# EAGLE design adapter (EAGLE 6.4)
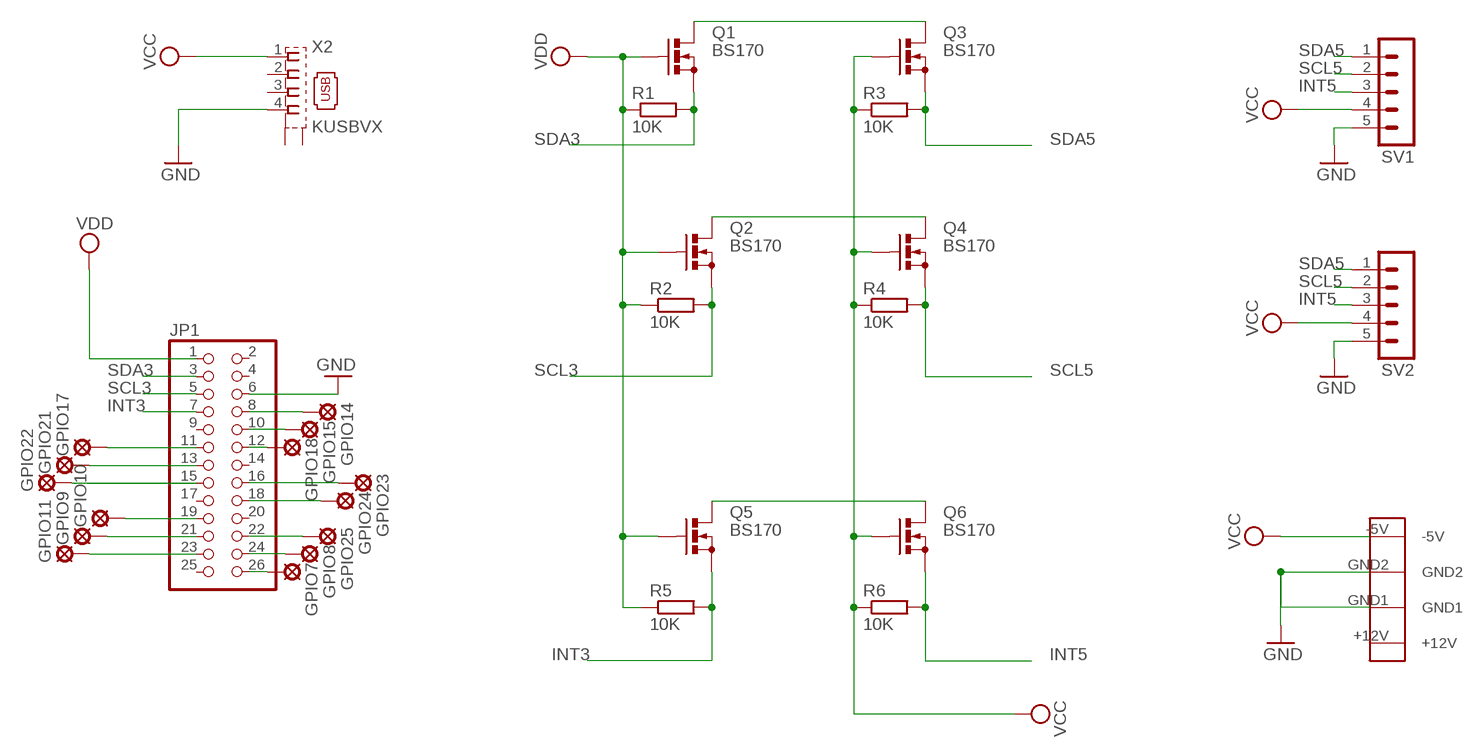
[diagram p0: schematic, sheet 1]

## Parts
GPIO7  LSP10  [LSP10]
GPIO8  LSP10  [LSP10]
GPIO9  LSP10  [LSP10]
GPIO10  LSP10  [LSP10]
GPIO11  LSP10  [LSP10]
GPIO14  LSP10  [LSP10]
GPIO15  LSP10  [LSP10]
GPIO17  GPIO17  LSP10  [LSP10]
GPIO18  LSP10  [LSP10]
GPIO21  LSP10  [LSP10]
GPIO22  LSP10  [LSP10]
GPIO23  LSP10  [LSP10]
GPIO24  LSP10  [LSP10]
GPIO25  LSP10  [LSP10]
JP1  PINHD-2X13  [2X13]
Q1  BS170  [SOT54E]
Q2  BS170  [SOT54E]
Q3  BS170  [SOT54E]
Q4  BS170  [SOT54E]
Q5  BS170  [SOT54E]
Q6  BS170  [SOT54E]
R1  10K  R-EU_0207/2V  [0207/2V]
R2  10K  R-EU_0207/2V  [0207/2V]
R3  10K  R-EU_0207/2V  [0207/2V]
R4  10K  R-EU_0207/2V  [0207/2V]
R5  10K  R-EU_0207/2V  [0207/2V]
R6  10K  R-EU_0207/2V  [0207/2V]
SV1  MA05-1  [MA05-1]
SV2  MA05-1  [MA05-1]
U$1  PSW_5  [PSW_5]
X2  KUSBVX  [KUSBVX]

## Nets
GND: JP1.6 SV1.5 SV2.5 U$1.GND1 U$1.GND2 X2.4
INT3: JP1.7 Q5.S R5.2
INT5: Q6.S R6.2 SV1.3 SV2.3
N$1: GPIO17.MP JP1.11
N$2: GPIO21.MP JP1.13
N$3: GPIO22.MP JP1.15
N$4: GPIO10.MP JP1.19
N$5: GPIO9.MP JP1.21
N$6: GPIO11.MP JP1.23
N$7: GPIO14.MP JP1.8
N$8: GPIO15.MP JP1.10
N$9: GPIO18.MP JP1.12
N$10: GPIO23.MP JP1.16
N$11: GPIO24.MP JP1.18
N$12: GPIO25.MP JP1.22
N$13: GPIO8.MP JP1.24
N$14: GPIO7.MP JP1.26
N$15: Q1.D Q3.D
N$16: Q2.D Q4.D
N$17: Q5.D Q6.D
SCL3: JP1.5 Q2.S R2.2
SCL5: Q4.S R4.2 SV1.2 SV2.2
SDA3: JP1.3 Q1.S R1.2
SDA5: Q3.S R3.2 SV1.1 SV2.1
VCC: Q3.G Q4.G Q6.G R3.1 R4.1 R6.1 SV1.4 SV2.4 U$1.-5V X2.1
VDD: JP1.1 Q1.G Q2.G Q5.G R1.1 R2.1 R5.1
Unconnected: JP1.2 JP1.4 JP1.9 JP1.14 JP1.17 JP1.20 JP1.25 U$1.+12V X2.2 X2.3 X2.M1(S1) X2.M2(S2)

## Library data of the parts
GPIO7-GPIO11 GPIO14 GPIO15 GPIO17 GPIO18 GPIO21-GPIO25 = solpad:LSP10: SOLDER PAD drill 1.0 mm, distributor Buerklin, 12H555
JP1 = pinhead:PINHD-2X13: PIN HEADER
Q1-Q6 = transistor-small-signal:BS170: N-CHANNEL MOS FET
R1-R6 = resistor:R-EU_: RESISTOR, European symbol
SV1 SV2 = con-lstb:MA05-1: PIN HEADER; OC_FARNELL: unknown; OC_NEWARK: unknown
U$1 = n39:PSW_5: PSW 5 Stromversorgungsstecker f. 5 1/4 Zoll, Print, gew. http://www.reichelt.de/Floppy-Powerstecker/PSW-5/3/index.html?;ACTION=3;LA=446;ARTICLE=14915;GROUPID=3257;artnr=PSW+5;SID=11UOMKs38AAAIAABbvFEc5b11be4da1ac9cc045b827e422a49e7b
X2 = con-kycon:KUSBVX: Vertical,Top Entry Universal Serial Bus Connector KUSBVX Series Source: KYCON Sibalco USB vertical socket KUSBV.pdf

## Board
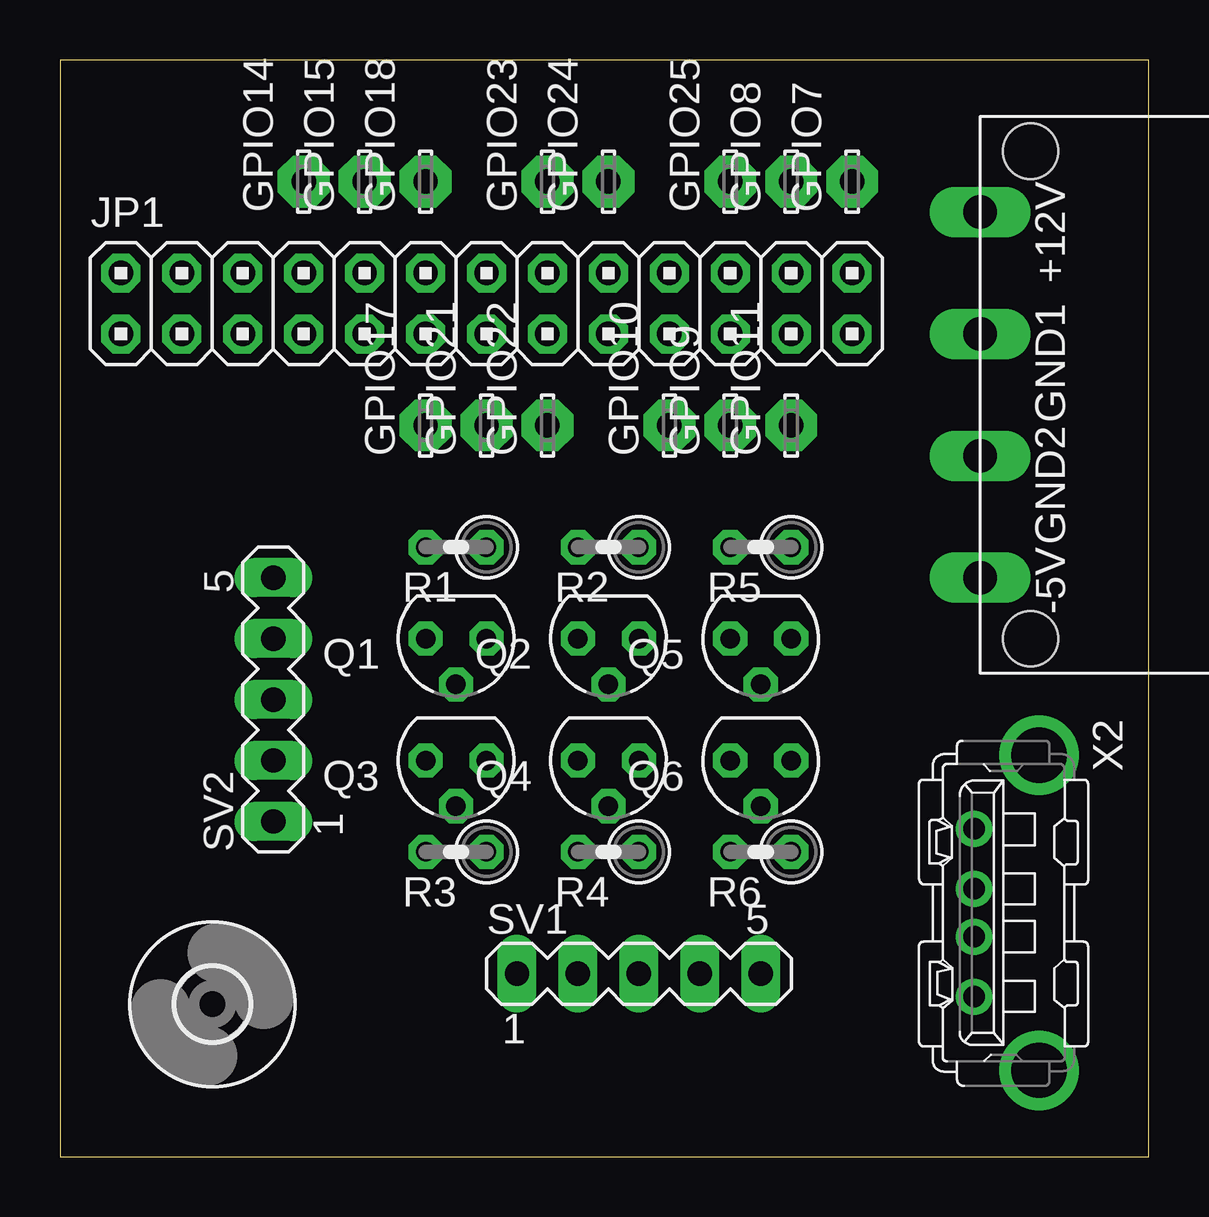
[diagram p1: board, top side]
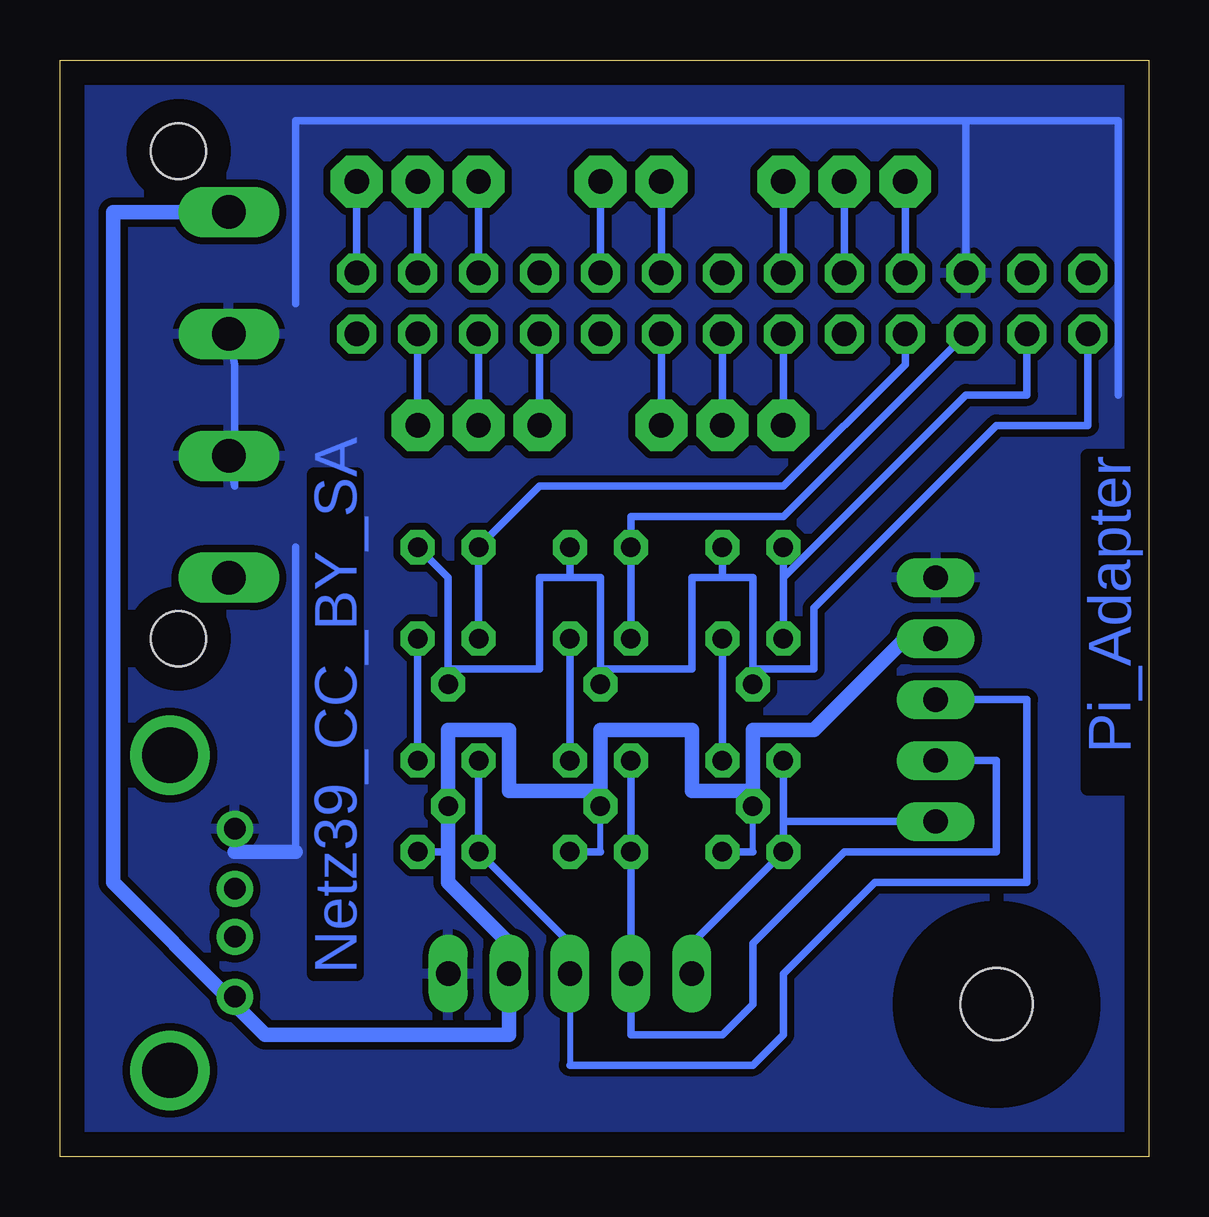
[diagram p2: board, bottom side, seen from below]

Size 45.39 x 45.71 mm. Coordinates in mm from the lower left corner, seen from the top.
Outline: 0,0 45.39,0 45.39,45.71 0,45.71 0,0
Copper layers (1*16): Top 0.035mm / dielectric 1.5mm / Bottom 0.035mm
Design rules "default *": minimum track width 10mil, minimum drill 24mil, track to track 12mil, track to pad 12mil, pad to pad 10mil, via to via 10mil, smd to smd 8mil, copper to edge 40mil, drill to drill 8mil, minimum pad ring 12mil, minimum via ring 8mil, stop-mask expansion 4mil, vias tented up to drill 0mil, thermal gap 10mil

### Footprints (pad centres in the part's own frame; a part is rotated, then mirrored left to right if it is on the bottom)
LSP10 = drill 1.016 pad 2.159 octagon: MP 0,0
2X13 = drill 1.016 octagon: 1 -15.24,-1.27; 2 -15.24,1.27; 3 -12.7,-1.27; 4 -12.7,1.27; 5 -10.16,-1.27; 6 -10.16,1.27; 7 -7.62,-1.27; 8 -7.62,1.27; 9 -5.08,-1.27; 10 -5.08,1.27; 11 -2.54,-1.27; 12 -2.54,1.27; 13 0,-1.27; 14 0,1.27; 15 2.54,-1.27; 16 2.54,1.27; 17 5.08,-1.27; 18 5.08,1.27; 19 7.62,-1.27; 20 7.62,1.27; 21 10.16,-1.27; 22 10.16,1.27; 23 12.7,-1.27; 24 12.7,1.27; 25 15.24,-1.27; 26 15.24,1.27
SOT54E = drill 0.813 octagon: D -1.27,0; G 0,1.905; S 1.27,0
0207/2V = drill 0.813 octagon: 1 -1.27,0; 2 1.27,0
MA05-1 = drill 1.016 long: 1 -5.08,0; 2 -2.54,0; 3 0,0; 4 2.54,0; 5 5.08,0
PSW_5 = drill 1.4 long: +12V 7.62,-6.1; -5V -7.62,-6.1; GND1 -2.54,-6.1; GND2 2.54,-6.1 | hole 2.3: -10.16,-4; 10.16,-4
3,0 = hole 3: 0,0
KUSBVX = drill 0.9 pad 1.3: 1 3.5,0; 2 1,0; 3 -1,0; 4 -3.5,0 | drill 2.3 pad 2.8: M1 -6.57,2.71; M2 6.57,2.71

### Placement (x,y rotation side)
GPIO7  33.02,40.64 90 top
GPIO8  30.48,40.64 90 top
GPIO9  27.94,30.48 90 top
GPIO10  25.4,30.48 90 top
GPIO11  30.48,30.48 90 top
GPIO14  10.16,40.64 90 top
GPIO15  12.7,40.64 90 top
GPIO17  15.24,30.48 90 top
GPIO18  15.24,40.64 90 top
GPIO21  17.78,30.48 90 top
GPIO22  20.32,30.48 90 top
GPIO23  20.32,40.64 90 top
GPIO24  22.86,40.64 90 top
GPIO25  27.94,40.64 90 top
JP1  17.78,35.56 0 top
Q1  16.51,21.59 180 top
Q2  22.86,21.59 180 top
Q3  16.51,16.51 180 top
Q4  22.86,16.51 180 top
Q5  29.21,21.59 180 top
Q6  29.21,16.51 180 top
R1  16.51,25.4 180 top
R2  22.86,25.4 180 top
R3  16.51,12.7 180 top
R4  22.86,12.7 180 top
R5  29.21,25.4 180 top
R6  29.21,12.7 180 top
SV1  24.13,7.62 0 top
SV2  8.89,19.05 90 top
U$1  44.45,31.75 270 top
U$2  [3,0]  6.35,6.35 0 top
X2  38.1,10.16 270 top

### Tracks (layer width: path | path; a pad name or v marks a point on that pad's centre or on a via)
GND
  Bottom 0.305: 1.27,31.75 1.27,43.18 7.62,43.18 | 38.1,12.7 X2.4 | 35.56,12.7 35.56,25.4 | U$1.GND2 38.1,27.94 38.1,33.02 U$1.GND1 | 7.62,43.18 JP1.6 | 7.62,43.18 35.56,43.18 35.56,35.56
  Bottom 0.61: 38.1,12.7 35.56,12.7
  pour Bottom (isolate 0.254): -2.54,45.72 45.72,45.72 45.72,-3.81 -2.54,-3.81
INT3
  Bottom 0.305: Q5.S R5.2 25.4,27.94 15.24,27.94 10.16,33.02 JP1.7
INT5
  Bottom 0.254: SV1.3 24.13,3.81
  Bottom 0.305: Q6.S R6.2 24.13,8.89 SV1.3 | SV2.3 5.08,19.05 5.08,11.43 11.43,11.43 15.24,7.62 15.24,5.08 16.51,3.81 24.13,3.81
N$1
  Bottom 0.305: GPIO17.MP JP1.11
N$2
  Bottom 0.305: GPIO21.MP JP1.13
N$3
  Bottom 0.305: GPIO22.MP JP1.15
N$4
  Bottom 0.305: GPIO10.MP JP1.19
N$5
  Bottom 0.305: GPIO9.MP JP1.21
N$6
  Bottom 0.305: GPIO11.MP JP1.23
N$7
  Bottom 0.305: GPIO14.MP JP1.8
N$8
  Bottom 0.305: GPIO15.MP JP1.10
N$9
  Bottom 0.305: GPIO18.MP JP1.12
N$10
  Bottom 0.305: GPIO23.MP JP1.16
N$11
  Bottom 0.305: GPIO24.MP JP1.18
N$12
  Bottom 0.305: GPIO25.MP JP1.22
N$13
  Bottom 0.305: GPIO8.MP JP1.24
N$14
  Bottom 0.305: GPIO7.MP JP1.26
N$15
  Bottom 0.305: Q1.D Q3.D
N$16
  Bottom 0.305: Q2.D Q4.D
N$17
  Bottom 0.305: Q5.D Q6.D
SCL3
  Bottom 0.305: Q2.S R2.2 21.59,26.67 15.24,26.67 JP1.5
SCL5
  Bottom 0.305: Q4.S R4.2 SV1.2 21.59,5.08 17.78,5.08 16.51,6.35 16.51,8.89 12.7,12.7 6.35,12.7 6.35,16.51 SV2.2
SDA3
  Bottom 0.305: R1.2 15.24,24.13 | 15.24,24.13 Q1.S | 15.24,24.13 7.62,31.75 5.08,31.75 JP1.3
SDA5
  Bottom 0.305: Q3.S 15.24,13.97 | 15.24,13.97 R3.2 19.05,8.89 SV1.1 | SV2.1 15.24,13.97
VCC
  Bottom 0.254: 22.86,12.7 Q4.G 22.86,15.24 | 16.51,12.7 Q3.G 16.51,15.24
  Bottom 0.305: R4.1 22.86,12.7 | R3.1 16.51,12.7 | 38.1,6.35 X2.1 | 29.21,12.7 R6.1
  Bottom 0.61: SV2.4 10.16,21.59 13.97,17.78 16.51,17.78 16.51,15.24 19.05,15.24 19.05,17.78 22.86,17.78 22.86,15.24 26.67,15.24 26.67,17.78 29.21,17.78 Q6.G 29.21,12.7 29.21,11.43 26.67,8.89 SV1.4 26.67,5.08 36.83,5.08 38.1,6.35 43.18,11.43 43.18,39.37 U$1.-5V
VDD
  Bottom 0.305: 29.21,20.32 29.21,24.13 R5.1 | 24.13,24.13 22.86,24.13 22.86,20.32 | R2.1 24.13,24.13 | 16.51,20.32 16.51,24.13 17.78,24.13 | JP1.1 2.54,30.48 6.35,30.48 13.97,22.86 13.97,20.32 16.51,20.32 | 16.51,20.32 Q1.G | 22.86,20.32 19.05,20.32 19.05,24.13 17.78,24.13 | 22.86,20.32 Q2.G | 29.21,20.32 25.4,20.32 25.4,24.13 24.13,24.13 | 29.21,20.32 Q5.G | R1.1 17.78,24.13

### Text on the board
Bottom: Pi_Adapter | Netz39_CC_BY_SA